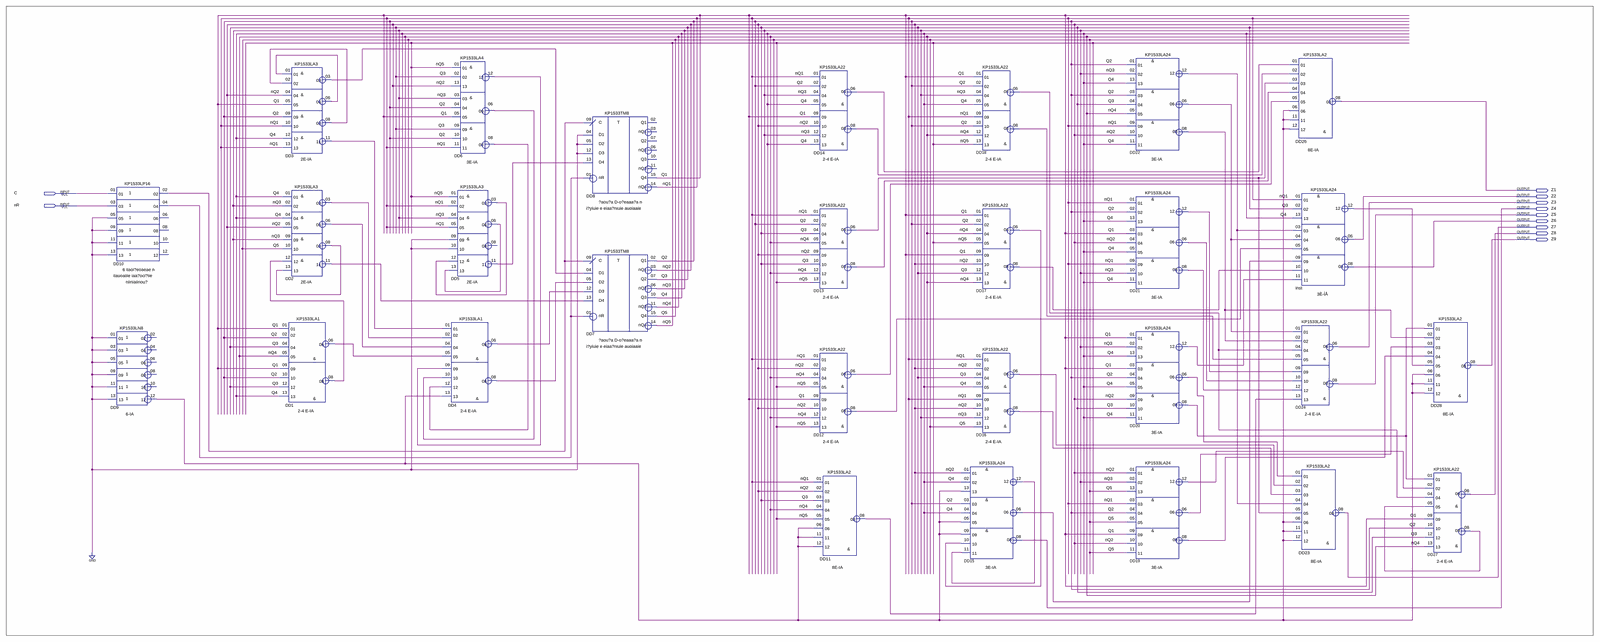
[diagram p0: schematic sheet, whole]
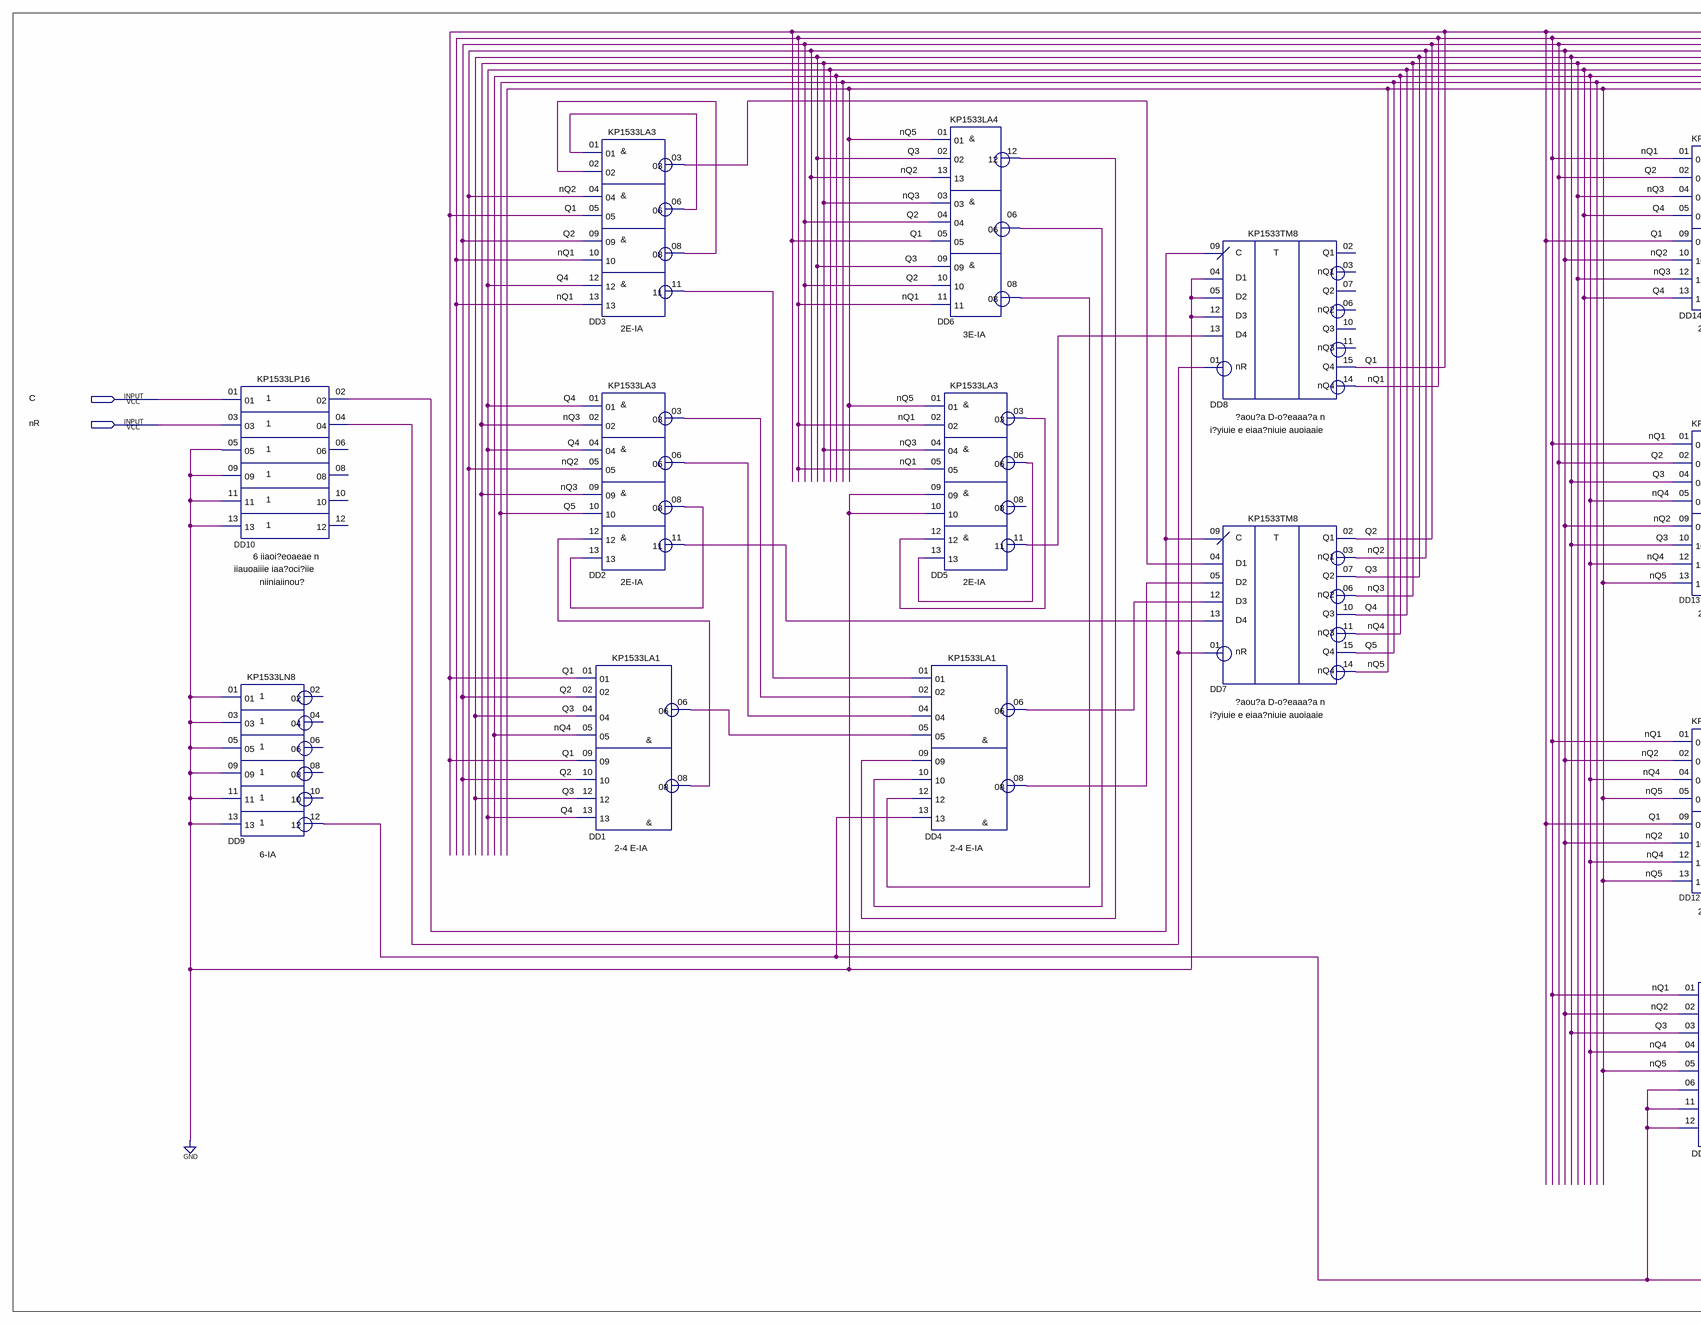
[diagram p1: schematic sheet, left part]
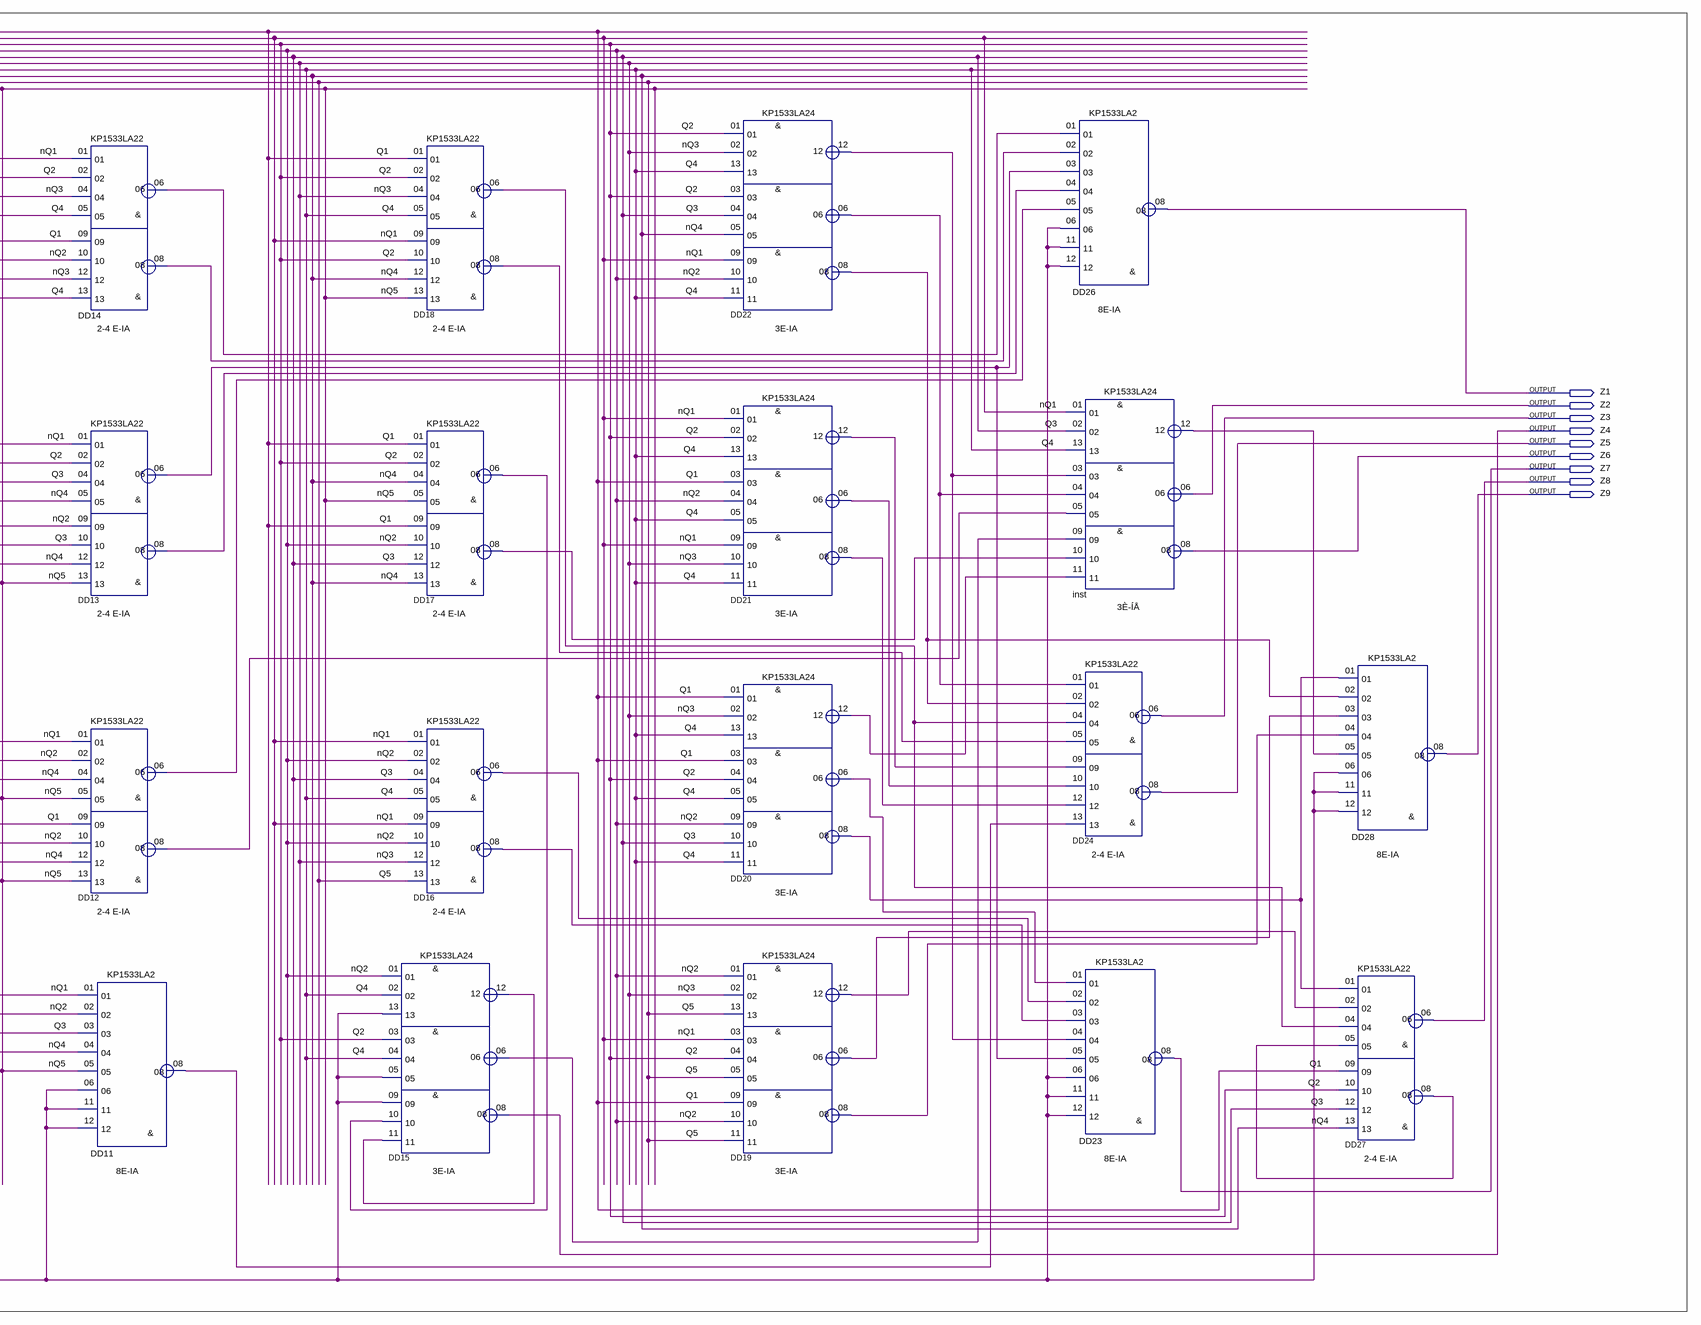
[diagram p2: schematic sheet, right part]
// Quartus schematic GN_BC_DFF_PK_NAND.bdf as structural Verilog: 28 symbols, 11 pins
module GN_BC_DFF_PK_NAND (
  input  C,
  input  nR,
  output Z1,
  output Z2,
  output Z3,
  output Z4,
  output Z5,
  output Z6,
  output Z7,
  output Z8,
  output Z9
);

  wire DD1_06, DD1_08, DD2_03, DD2_06, DD2_08, DD2_11, DD3_03, DD3_06, DD3_08, DD3_11, DD4_06, DD4_08,
       DD5_03, DD5_06, DD5_11, DD6_06, DD6_08, DD6_12, DD9_12, DD10_02, DD10_04, DD11_08, DD12_06, DD12_08,
       DD13_06, DD13_08, DD14_06, DD14_08, DD15_06, DD15_12, DD16_06, DD16_08, DD17_06, DD17_08, DD18_06,
       DD18_08, DD19_06, DD19_08, DD19_12, DD20_06, DD20_08, DD20_12, DD21_06, DD21_08, DD21_12, DD22_06,
       DD22_08, DD22_12, DD27_08, inst_12, nQ1, nQ2, nQ3, nQ4, nQ5, Q1, Q2, Q3, Q4, Q5;

  KP1533LP16 DD10 (
    .\01 (C), .\03 (nR), .\05 (1'b0), .\09 (1'b0), .\11 (1'b0), .\13 (1'b0), .\02 (DD10_02), .\04 (DD10_04));  // open: 06, 08, 10, 12
  KP1533LN8 DD9 (
    .\01 (1'b0), .\03 (1'b0), .\05 (1'b0), .\09 (1'b0), .\11 (1'b0), .\13 (1'b0), .\12 (DD9_12));  // open: 02, 04, 06, 08, 10
  KP1533LA1 DD1 (
    .\01 (Q1), .\02 (Q2), .\04 (Q3), .\05 (nQ4), .\09 (Q1), .\10 (Q2), .\12 (Q3), .\13 (Q4), .\06 (DD1_06),
    .\08 (DD1_08));
  KP1533LA3 DD3 (
    .\01 (DD3_06), .\02 (DD3_08), .\04 (nQ2), .\05 (Q1), .\09 (Q2), .\10 (nQ1), .\12 (Q4), .\13 (nQ1),
    .\03 (DD3_03), .\06 (DD3_06), .\08 (DD3_08), .\11 (DD3_11));
  KP1533LA3 DD2 (
    .\01 (Q4), .\02 (nQ3), .\04 (Q4), .\05 (nQ2), .\09 (nQ3), .\10 (Q5), .\12 (DD1_08), .\13 (DD2_08),
    .\03 (DD2_03), .\06 (DD2_06), .\08 (DD2_08), .\11 (DD2_11));
  KP1533LA4 DD6 (
    .\01 (nQ5), .\02 (Q3), .\13 (nQ2), .\03 (nQ3), .\04 (Q2), .\05 (Q1), .\09 (Q3), .\10 (Q2), .\11 (nQ1),
    .\12 (DD6_12), .\06 (DD6_06), .\08 (DD6_08));
  KP1533LA3 DD5 (
    .\01 (nQ5), .\02 (nQ1), .\04 (nQ3), .\05 (nQ1), .\09 (1'b0), .\10 (1'b0), .\12 (DD5_03), .\13 (DD5_06),
    .\03 (DD5_03), .\06 (DD5_06), .\11 (DD5_11));  // open: 08
  KP1533LA1 DD4 (
    .\01 (DD3_11), .\02 (DD2_03), .\04 (DD2_06), .\05 (DD1_06), .\09 (DD6_12), .\10 (DD6_06), .\12 (DD6_08),
    .\13 (DD9_12), .\06 (DD4_06), .\08 (DD4_08));
  KP1533TM8 DD8 (
    .nR(DD10_04), .C(DD10_02), .D1(1'b0), .D2(1'b0), .D3(1'b0), .D4(DD5_11), .Q4(Q1), .nQ4(nQ1));  // open: Q1, nQ1, Q2, nQ2, Q3, nQ3
  KP1533TM8 DD7 (
    .nR(DD10_04), .C(DD10_02), .D1(DD3_03), .D2(DD4_08), .D3(DD4_06), .D4(DD2_11), .Q1(Q2), .nQ1(nQ2),
    .Q2(Q3), .nQ2(nQ3), .Q3(Q4), .nQ3(nQ4), .Q4(Q5), .nQ4(nQ5));
  KP1533LA22 DD14 (
    .\01 (nQ1), .\02 (Q2), .\04 (nQ3), .\05 (Q4), .\09 (Q1), .\10 (nQ2), .\12 (nQ3), .\13 (Q4),
    .\06 (DD14_06), .\08 (DD14_08));
  KP1533LA22 DD13 (
    .\01 (nQ1), .\02 (Q2), .\04 (Q3), .\05 (nQ4), .\09 (nQ2), .\10 (Q3), .\12 (nQ4), .\13 (nQ5),
    .\06 (DD13_06), .\08 (DD13_08));
  KP1533LA22 DD12 (
    .\01 (nQ1), .\02 (nQ2), .\04 (nQ4), .\05 (nQ5), .\09 (Q1), .\10 (nQ2), .\12 (nQ4), .\13 (nQ5),
    .\06 (DD12_06), .\08 (DD12_08));
  KP1533LA2 DD11 (
    .\01 (nQ1), .\02 (nQ2), .\03 (Q3), .\04 (nQ4), .\05 (nQ5), .\06 (DD9_12), .\11 (DD9_12), .\12 (DD9_12),
    .\08 (DD11_08));
  KP1533LA24 DD15 (
    .\01 (nQ2), .\02 (Q4), .\13 (DD9_12), .\03 (Q2), .\04 (Q4), .\05 (DD9_12), .\09 (DD9_12), .\10 (DD17_06),
    .\11 (DD15_12), .\12 (DD15_12), .\06 (DD15_06), .\08 (Z4));
  KP1533LA22 DD18 (
    .\01 (Q1), .\02 (Q2), .\04 (nQ3), .\05 (Q4), .\09 (nQ1), .\10 (Q2), .\12 (nQ4), .\13 (nQ5),
    .\06 (DD18_06), .\08 (DD18_08));
  KP1533LA22 DD17 (
    .\01 (Q1), .\02 (Q2), .\04 (nQ4), .\05 (nQ5), .\09 (Q1), .\10 (nQ2), .\12 (Q3), .\13 (nQ4),
    .\06 (DD17_06), .\08 (DD17_08));
  KP1533LA22 DD16 (
    .\01 (nQ1), .\02 (nQ2), .\04 (Q3), .\05 (Q4), .\09 (nQ1), .\10 (nQ2), .\12 (nQ3), .\13 (Q5),
    .\06 (DD16_06), .\08 (DD16_08));
  KP1533LA24 DD22 (
    .\01 (Q2), .\02 (nQ3), .\13 (Q4), .\03 (Q2), .\04 (Q3), .\05 (nQ4), .\09 (nQ1), .\10 (nQ2), .\11 (Q4),
    .\12 (DD22_12), .\06 (DD22_06), .\08 (DD22_08));
  KP1533LA24 DD21 (
    .\01 (nQ1), .\02 (Q2), .\13 (Q4), .\03 (Q1), .\04 (nQ2), .\05 (Q4), .\09 (nQ1), .\10 (nQ3), .\11 (Q4),
    .\12 (DD21_12), .\06 (DD21_06), .\08 (DD21_08));
  KP1533LA24 DD20 (
    .\01 (Q1), .\02 (nQ3), .\13 (Q4), .\03 (Q1), .\04 (Q2), .\05 (Q4), .\09 (nQ2), .\10 (Q3), .\11 (Q4),
    .\12 (DD20_12), .\06 (DD20_06), .\08 (DD20_08));
  KP1533LA24 DD19 (
    .\01 (nQ2), .\02 (nQ3), .\13 (Q5), .\03 (nQ1), .\04 (Q2), .\05 (Q5), .\09 (Q1), .\10 (nQ2), .\11 (Q5),
    .\12 (DD19_12), .\06 (DD19_06), .\08 (DD19_08));
  KP1533LA2 DD26 (
    .\01 (DD14_06), .\02 (DD14_08), .\03 (DD13_06), .\04 (DD13_08), .\05 (DD12_06), .\06 (DD9_12),
    .\11 (DD9_12), .\12 (DD9_12), .\08 (Z1));
  KP1533LA24 inst (
    .\01 (nQ1), .\02 (Q3), .\13 (Q4), .\03 (DD22_12), .\04 (DD22_06), .\05 (DD12_08), .\09 (DD15_06),
    .\10 (DD17_08), .\11 (DD20_12), .\12 (inst_12), .\06 (Z2), .\08 (Z6));
  KP1533LA22 DD24 (
    .\01 (DD22_06), .\02 (DD22_08), .\04 (DD18_06), .\05 (DD18_08), .\09 (DD21_12), .\10 (DD21_06),
    .\12 (DD21_08), .\13 (DD11_08), .\06 (Z3), .\08 (Z5));
  KP1533LA2 DD23 (
    .\01 (DD20_06), .\02 (DD16_06), .\03 (DD16_08), .\04 (DD22_12), .\05 (DD13_06), .\06 (DD9_12),
    .\11 (DD9_12), .\12 (DD9_12), .\08 (Z7));
  KP1533LA2 DD28 (
    .\01 (DD20_08), .\02 (DD22_08), .\03 (DD19_06), .\04 (DD19_08), .\05 (inst_12), .\06 (DD9_12),
    .\11 (DD9_12), .\12 (DD9_12), .\08 (Z9));
  KP1533LA22 DD27 (
    .\01 (DD20_08), .\02 (DD19_12), .\04 (DD18_06), .\05 (DD27_08), .\09 (Q1), .\10 (Q2), .\12 (Q3),
    .\13 (nQ4), .\06 (Z8), .\08 (DD27_08));
endmodule
